# EAGLE design schema (EAGLE 6.5.0)
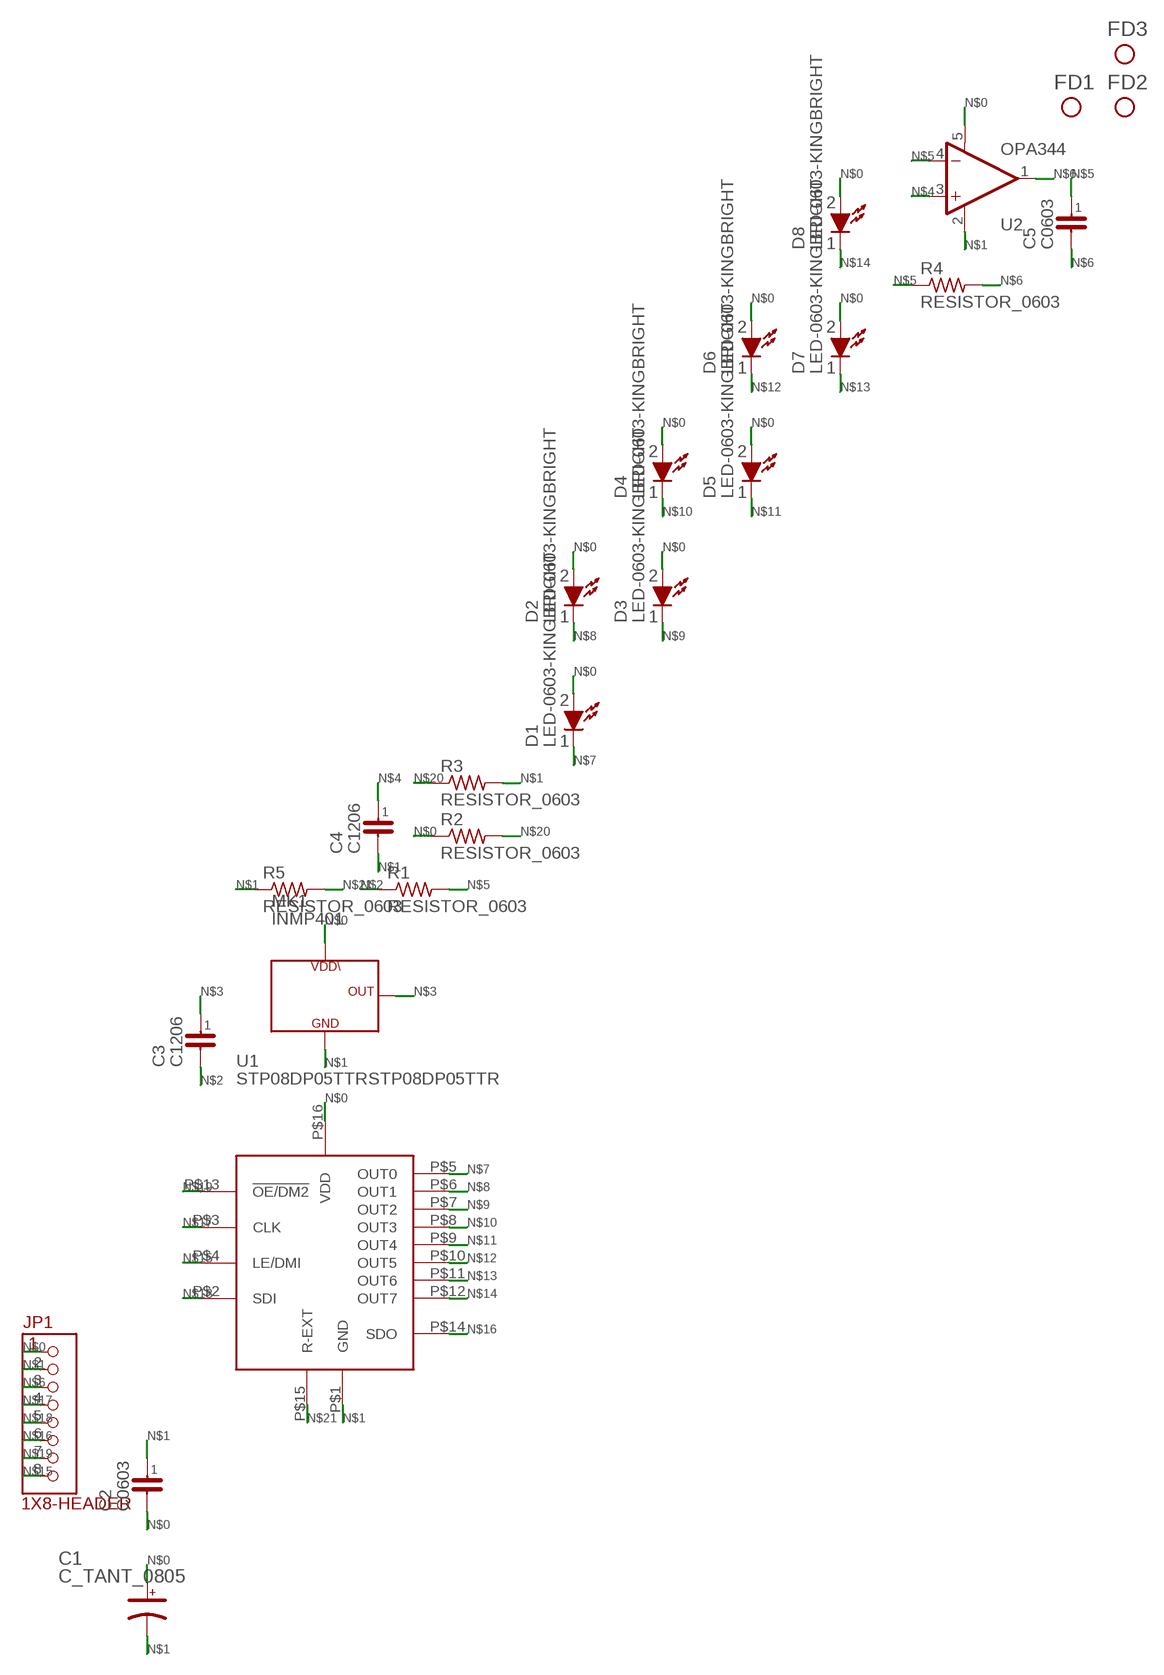
[diagram p0: schematic, sheet 1]

## Parts
C1  C_TANT_0805  [AVX-0805]
C2  C0603  [C0603]
C3  C1206  [C1206]
C4  C1206  [C1206]
C5  C0603  [C0603]
D1  LED-0603-KINGBRIGHT  [0603-LED-KINGBRIGHT]
D2  LED-0603-KINGBRIGHT  [0603-LED-KINGBRIGHT]
D3  LED-0603-KINGBRIGHT  [0603-LED-KINGBRIGHT]
D4  LED-0603-KINGBRIGHT  [0603-LED-KINGBRIGHT]
D5  LED-0603-KINGBRIGHT  [0603-LED-KINGBRIGHT]
D6  LED-0603-KINGBRIGHT  [0603-LED-KINGBRIGHT]
D7  LED-0603-KINGBRIGHT  [0603-LED-KINGBRIGHT]
D8  LED-0603-KINGBRIGHT  [0603-LED-KINGBRIGHT]
FD1  FIDUCIAL_1MM  [FIDUCIAL_1MM]
FD2  FIDUCIAL_1MM  [FIDUCIAL_1MM]
FD3  FIDUCIAL_1MM  [FIDUCIAL_1MM]
JP1  1X8-HEADER  [1X8-HEADER]
MK1  INMP401  [INMP401]
R1  RESISTOR_0603  [R_0603]
R2  RESISTOR_0603  [R_0603]
R3  RESISTOR_0603  [R_0603]
R4  RESISTOR_0603  [R_0603]
R5  RESISTOR_0603  [R_0603]
U1  STP08DP05TTRSTP08DP05TTR  [STP08DP05TTR]
U2  OPA344  [SOT23-5]

## Nets
N$0: C1.POS C2.2 D1.P$2 D2.P$2 D3.P$2 D4.P$2 D5.P$2 D6.P$2 D7.P$2 D8.P$2 JP1.1 MK1.5(VDD) R2.P$1 U1.P$16(VDD) U2.5(V+)
N$1: C1.NEG C2.1 C4.2 JP1.2 MK1.2(GND) MK1.4(GND) MK1.6(GND) R3.P$2 R5.P$1 U1.P$1(GND) U2.2(V-)
N$2: C3.2 R1.P$1
N$3: C3.1 MK1.1(OUT)
N$4: C4.1 U2.3(+IN)
N$5: C5.1 R1.P$2 R4.P$1 U2.4(-IN)
N$6: C5.2 JP1.3 R4.P$2 U2.1(OUT)
N$7: D1.P$1 U1.P$5(OUT0)
N$8: D2.P$1 U1.P$6(OUT1)
N$9: D3.P$1 U1.P$7(OUT2)
N$10: D4.P$1 U1.P$8(OUT3)
N$11: D5.P$1 U1.P$9(OUT4)
N$12: D6.P$1 U1.P$10(OUT5)
N$13: D7.P$1 U1.P$11(OUT6)
N$14: D8.P$1 U1.P$12(OUT7)
N$15: JP1.8 U1.P$4(LE/DMI)
N$16: JP1.6 U1.P$14(SDO)
N$17: JP1.4 U1.P$3(CLK)
N$18: JP1.5 U1.P$2(SDI)
N$19: JP1.7 U1.P$13(!OE/DM2)
N$20: R2.P$2 R3.P$1
N$21: R5.P$2 U1.P$15(R-EXT)
Unconnected: FD1.1 FD2.1 FD3.1

## Library data of the parts
C1 = ecad:C_TANT_0805
C2 C5 = chipCapacitors:C0603
C3 C4 = chipCapacitors:C1206
D1-D8 = VUmeterlib:LED-0603-KINGBRIGHT
FD1-FD3 = fiducials:FIDUCIAL_1MM
JP1 = ecad(1):1X8-HEADER
MK1 = VUmeterlib:INMP401
R1-R5 = chipResistors:RESISTOR_0603
U1 = VUmeterlib:STP08DP05TTR
U2 = VUmeterlib:OPA344

## Board
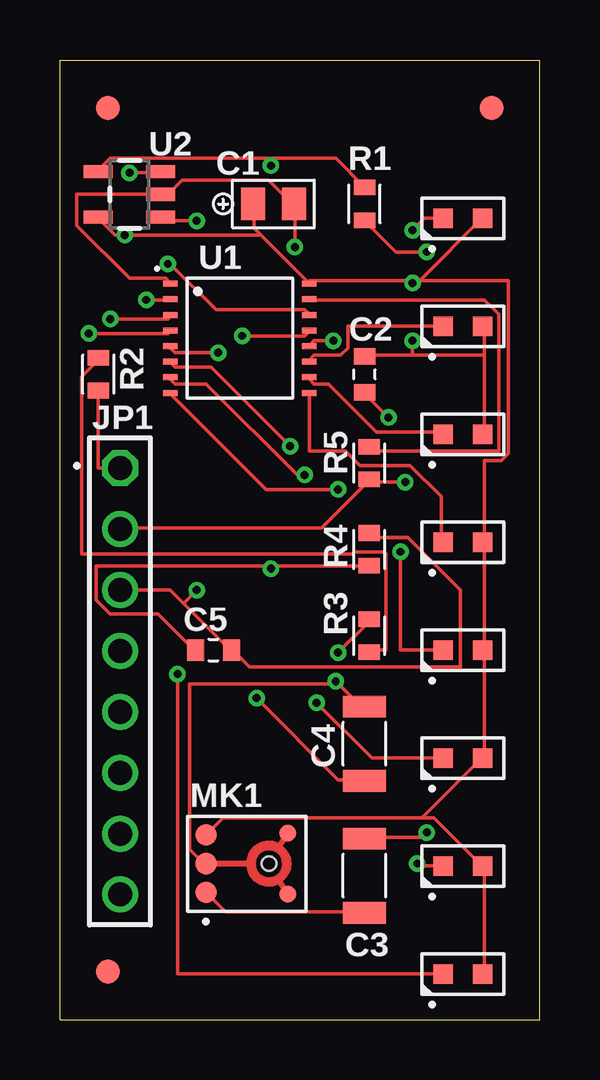
[diagram p1: board, top side]
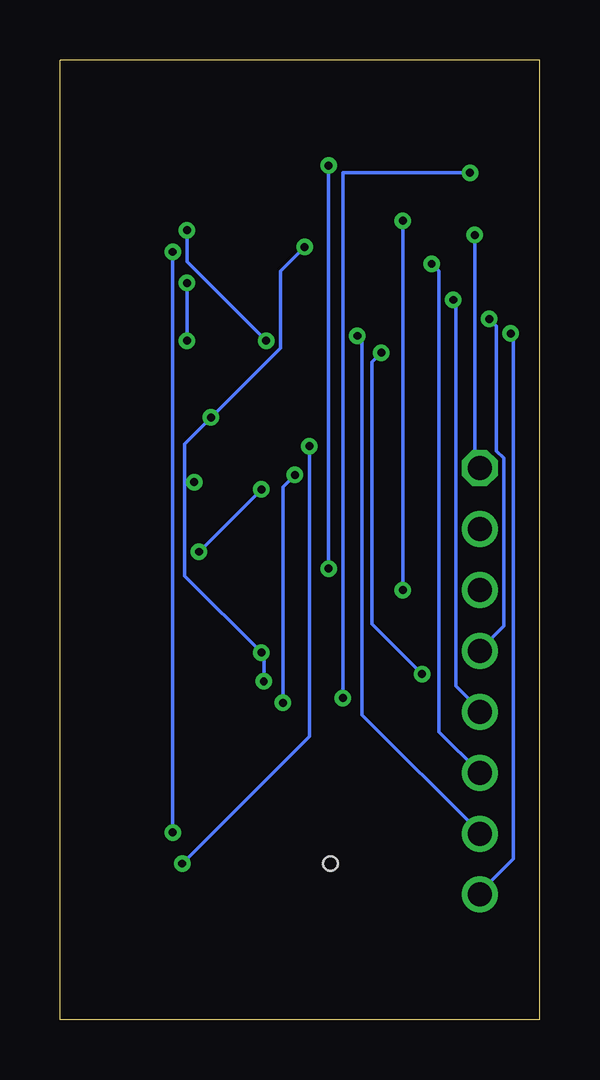
[diagram p2: board, bottom side, seen from below]

Size 20 x 40 mm. Coordinates in mm from the lower left corner, seen from the top.
Outline: 0,0 20,0
Outline: 0,40 20,40
Outline: 0,0 0,40
Outline: 20,0 20,40
Outline: 0,0 20,0
Outline: 0,40 20,40
Outline: 0,0 0,40
Outline: 20,0 20,40
Outline: 0,0 20,0
Outline: 0,40 20,40
Outline: 0,0 0,40
Outline: 20,0 20,40
Copper layers (1*16): Top 0.0356mm / dielectric 1.5011mm / Bottom 0.0356mm
Design rules "OSHPark2Layer": minimum track width 6mil, minimum drill 13mil, track to track 6mil, track to pad 6mil, pad to pad 12mil, via to via 12mil, smd to smd 6mil, copper to edge 0mil, drill to drill 6mil, minimum pad ring 7mil, minimum via ring 7mil, stop-mask expansion 3mil, vias tented up to drill 0mil, thermal gap 10mil
tRestrict: 4 lines
bRestrict: 4 lines

### Footprints (pad centres in the part's own frame; a part is rotated, then mirrored left to right if it is on the bottom)
AVX-0805 = smd 1 x 1.35: NEG 0.85,0; POS -0.85,0
C0603 = smd 0.7 x 0.9: 1 -0.75,0; 2 0.75,0
C1206 = smd 0.9 x 1.8: 1 -1.55,0; 2 1.55,0
0603-LED-KINGBRIGHT = smd 0.8 x 0.8: P$1 -0.825,0; P$2 0.825,0
FIDUCIAL_1MM = smd 1 x 1: 1 0,0
1X8-HEADER = drill 1 octagon: 1 0,8.89 | drill 1: 2 0,6.35; 3 0,3.81; 4 0,1.27; 5 0,-1.27; 6 0,-3.81; 7 0,-6.35; 8 0,-8.89
INMP401 = smd 0.9 x 0.9: 1 -1.705,-1.2; 5 -1.705,1.2; 6 -1.705,0 | smd 0.7 x 0.7: 2 1.705,-1.27; 4 1.705,1.27 | hole 0.6: 0.915,0
R_0603 = smd 0.65 x 0.9: P$1 -0.68,0; P$2 0.68,0
STP08DP05TTR = smd 0.6 x 0.25: P$1 -2.9,2.275; P$2 -2.9,1.625; P$3 -2.9,0.975; P$4 -2.9,0.325; P$5 -2.9,-0.325; P$6 -2.9,-0.975; P$7 -2.9,-1.625; P$8 -2.9,-2.275; P$9 2.9,-2.275; P$10 2.9,-1.625; P$11 2.9,-0.975; P$12 2.9,-0.325; P$13 2.9,0.325; P$14 2.9,0.975; P$15 2.9,1.625; P$16 2.9,2.275
SOT23-5 = smd 0.55 x 1.2: 1 -0.95,-1.3; 2 0,-1.3; 3 0.95,-1.3; 4 0.95,1.3; 5 -0.95,1.3

### Placement (x,y rotation side)
C1  8.9,34 0 top
C2  12.7,26.9 90 top
C3  12.7,6 90 top
C4  12.7,11.5 90 top
C5  6.4,15.4 0 top
D1  16.8,1.9 0 top
D2  16.8,6.4 0 top
D3  16.8,10.9 0 top
D4  16.8,15.4 0 top
D5  16.8,19.9 0 top
D6  16.8,24.4 0 top
D7  16.8,28.9 0 top
D8  16.8,33.4 0 top
FD1  2,2 0 top
FD2  2,38 0 top
FD3  18,38 0 top
JP1  2.5,14.1 0 top
MK1  7.8,6.5 0 top
R1  12.7,34 90 top
R2  1.6,26.9 90 top
R3  12.9,16 90 top
R4  12.9,19.6 90 top
R5  12.9,23.2 90 top
U1  7.5,28.4 0 top
U2  2.9,34.4 90 top

### Tracks (layer width: path | path; a pad name or v marks a point on that pad's centre or on a via)
N$0  (via drill 0.33)
  Top 0.152: 17.7,15.4 17.7,10.9 D3.P$2 17.6,10.9 15.1,8.4 | 17.7,15.4 17.7,19.9 | 17.7,15.4 D4.P$2 | D1.P$2 17.7,1.9 17.7,6.4 D2.P$2 17.6,6.4 15.6,8.4 15.1,8.4 | 15.1,8.4 6.8,8.4 MK1.5 | 17.7,27.7 17.7,28.9 D7.P$2 | 17.7,27.7 17.7,24.4 D6.P$2 | 17.7,27.7 14.7,27.7 | 14.7,27.7 12.7,27.7 C2.2 | R2.P$1 1.6,23 JP1.1 | 8.35,32.75 8.1,33 8.1,34 C1.POS | 8.35,32.75 10.35,30.75 | 10.35,30.75 10.4,30.7 U1.P$16 | 15.05,30.85 15,30.8 14.7,30.8 | 15.05,30.85 17.6,33.4 D8.P$2 | 14.7,30.8 10.4,30.8 10.35,30.75 | U2.5 1.6,33.4 2.3,32.7 v2.7,32.7 8.3,32.7 8.35,32.75 | v14.7,28.3 14.7,27.7 | 14.7,30.8 v14.7,30.7 | 17.7,19.9 17.7,23.3 18.4,23.3 18.7,23.6 18.7,30.8 15.1,30.8 15.05,30.85 | 17.7,19.9 D5.P$2
  Bottom 0.152: v2.7,32.7 2.7,23.2 JP1.1 | v14.7,30.7 v14.7,28.3
N$1  (via drill 0.33)
  Top 0.152: JP1.2 2.5,20.5 10.9,20.5 12.9,22.5 R5.P$1 12.9,22.4 v14.4,22.4 | U1.P$1 4.6,30.7 4.4,30.9 2.9,30.9 0.7,33.1 0.7,34.4 U2.2 4.5,34.4 5.1,35 8.7,35 9.7,34 C1.NEG 9.8,34 v9.8,32.2 | v11.6,15.3 12.9,16.6 R3.P$2 | C4.2 12.7,13.1 12.5,13.1 v11.5,14.1 11.5,14 5.4,14 5.4,7.1 6,6.5 MK1.6 | v13.7,25.1 12.7,26.1 C2.1
  Bottom 0.152: v11.5,14.1 11.5,15.2 v11.6,15.3 14.8,18.5 14.8,22.4 | 14.8,22.4 14.8,24 v13.7,25.1 10.8,28 10.8,31.2 v9.8,32.2 | 14.8,22.4 v14.4,22.4
N$2  (via drill 0.33)
  Top 0.152: v15.3,32 14,32 12.7,33.3 R1.P$1 | v15.3,7.8 15.1,7.6 12.7,7.6 C3.2
  Bottom 0.152: v15.3,7.8 v15.3,32
N$3
  Top 0.152: MK1.1 6.9,4.5 12.7,4.5 C3.1
N$4  (via drill 0.33)
  Top 0.152: v2.9,35.3 4.2,35.3 U2.3 | v8.2,13.4 11.6,10 12.7,10 C4.1
  Bottom 0.152: v2.9,35.3 8.2,35.3 v8.2,13.4
N$5  (via drill 0.33)
  Top 0.152: 8.8,35.9 2.1,35.9 1.6,35.4 U2.4 | 8.8,35.9 11.5,35.9 12.7,34.7 R1.P$2 | 8.8,18.9 12.9,18.9 R4.P$1 | 8.8,18.9 1.5,18.9 1.5,17.5 2.1,16.9 4.1,16.9 5.6,15.4 C5.1 | v8.8,35.6 8.8,35.9 | 8.8,18.9 v8.8,18.8
  Bottom 0.152: v8.8,18.8 v8.8,35.6
N$6  (via drill 0.33)
  Top 0.152: 5.15,17.35 4.6,17.9 JP1.3 | 5.15,17.35 7.1,15.4 C5.2 7.2,15.4 7.9,14.7 16.7,14.7 16.7,17.9 14.5,20.1 13,20.1 12.9,20.2 R4.P$2 | v5.7,33.3 4.4,33.3 4.3,33.4 U2.1 | 5.15,17.35 v5.7,17.9
  Bottom 0.152: v5.7,17.9 v5.7,33.3
N$7  (via drill 0.33)
  Top 0.152: v6.6,27.8 4.8,27.8 4.6,28 U1.P$5 | v4.9,14.4 4.9,1.9 D1.P$1
  Bottom 0.152: v6.6,27.8 7,27.4 7,16.5 v4.9,14.4
N$8  (via drill 0.33)
  Top 0.152: v9.6,23.9 6.3,27.2 4.8,27.2 4.6,27.4 U1.P$6 | v14.9,6.5 15,6.4 D2.P$1
  Bottom 0.152: v9.6,23.9 9.6,11.8 v14.9,6.5
N$9  (via drill 0.33)
  Top 0.152: v10.2,22.7 9.9,22.7 6.1,26.5 4.8,26.5 4.6,26.7 U1.P$7 | v10.7,13.2 13,10.9 D3.P$1
  Bottom 0.152: v10.2,22.7 10.7,22.2 v10.7,13.2
N$10  (via drill 0.33)
  Top 0.152: v11.6,22.1 8.6,22.1 4.6,26.1 U1.P$8 | v14.2,19.5 14.2,15.4 D4.P$1
  Bottom 0.152: v14.2,19.5 v11.6,22.1
N$11
  Top 0.152: U1.P$9 10.4,23.7 11.9,23.7 12.5,23.1 14.6,23.1 15.9,21.8 15.9,19.9 D5.P$1
N$12
  Top 0.152: U1.P$10 10.4,26.7 10.6,26.5 11.2,26.5 13.2,24.5 15.8,24.5 15.9,24.4 D6.P$1
N$13
  Top 0.152: D7.P$1 12,28.9 12,28 11.7,27.7 10.6,27.7 10.4,27.5 U1.P$11
N$14  (via drill 0.33)
  Top 0.152: v11.4,28.3 10.6,28.3 10.4,28.1 U1.P$12 | v14.7,32.9 15.2,33.4 D8.P$1
  Bottom 0.152: v11.4,28.3 14.7,31.6 v14.7,32.9
N$15  (via drill 0.33)
  Top 0.152: v1.2,28.6 4.5,28.6 4.6,28.7 U1.P$4
  Bottom 0.152: v1.2,28.6 1.1,28.5 1.1,6.7 2.5,5.3 JP1.8
N$16  (via drill 0.33)
  Top 0.152: v4.5,31.5 4.6,31.5 6.5,29.6 10.2,29.6 10.4,29.4 U1.P$14
  Bottom 0.152: v4.5,31.5 4.2,31.2 4.2,12 JP1.6
N$17  (via drill 0.33)
  Top 0.152: v2.1,29.2 4.5,29.2 4.6,29.3 U1.P$3
  Bottom 0.152: v2.1,29.2 1.8,28.9 1.8,23.7 1.5,23.4 1.5,16.4 2.5,15.4 JP1.4
N$18  (via drill 0.33)
  Top 0.152: v3.6,30 4.6,30 U1.P$2
  Bottom 0.152: v3.6,30 3.5,29.9 3.5,13.9 2.5,12.9 JP1.5
N$19  (via drill 0.33)
  Top 0.152: v7.6,28.5 10.2,28.5 10.4,28.7 U1.P$13
  Bottom 0.152: v7.6,28.5 7.4,28.3 7.4,12.7 2.5,7.8 JP1.7
N$20
  Top 0.152: R2.P$2 1.6,27.5 0.9,26.8 0.9,19.4 12.2,19.4 12.3,19.5 13.5,19.5 13.6,19.4 13.6,15.4 12.9,15.4 R3.P$1
N$21
  Top 0.152: U1.P$15 10.4,30 17.7,30 18.3,29.4 18.3,23.7 13,23.7 12.9,23.8 R5.P$2